# EAGLE schematic alte_schaltung_nicer2 (EAGLE 6.5.0)
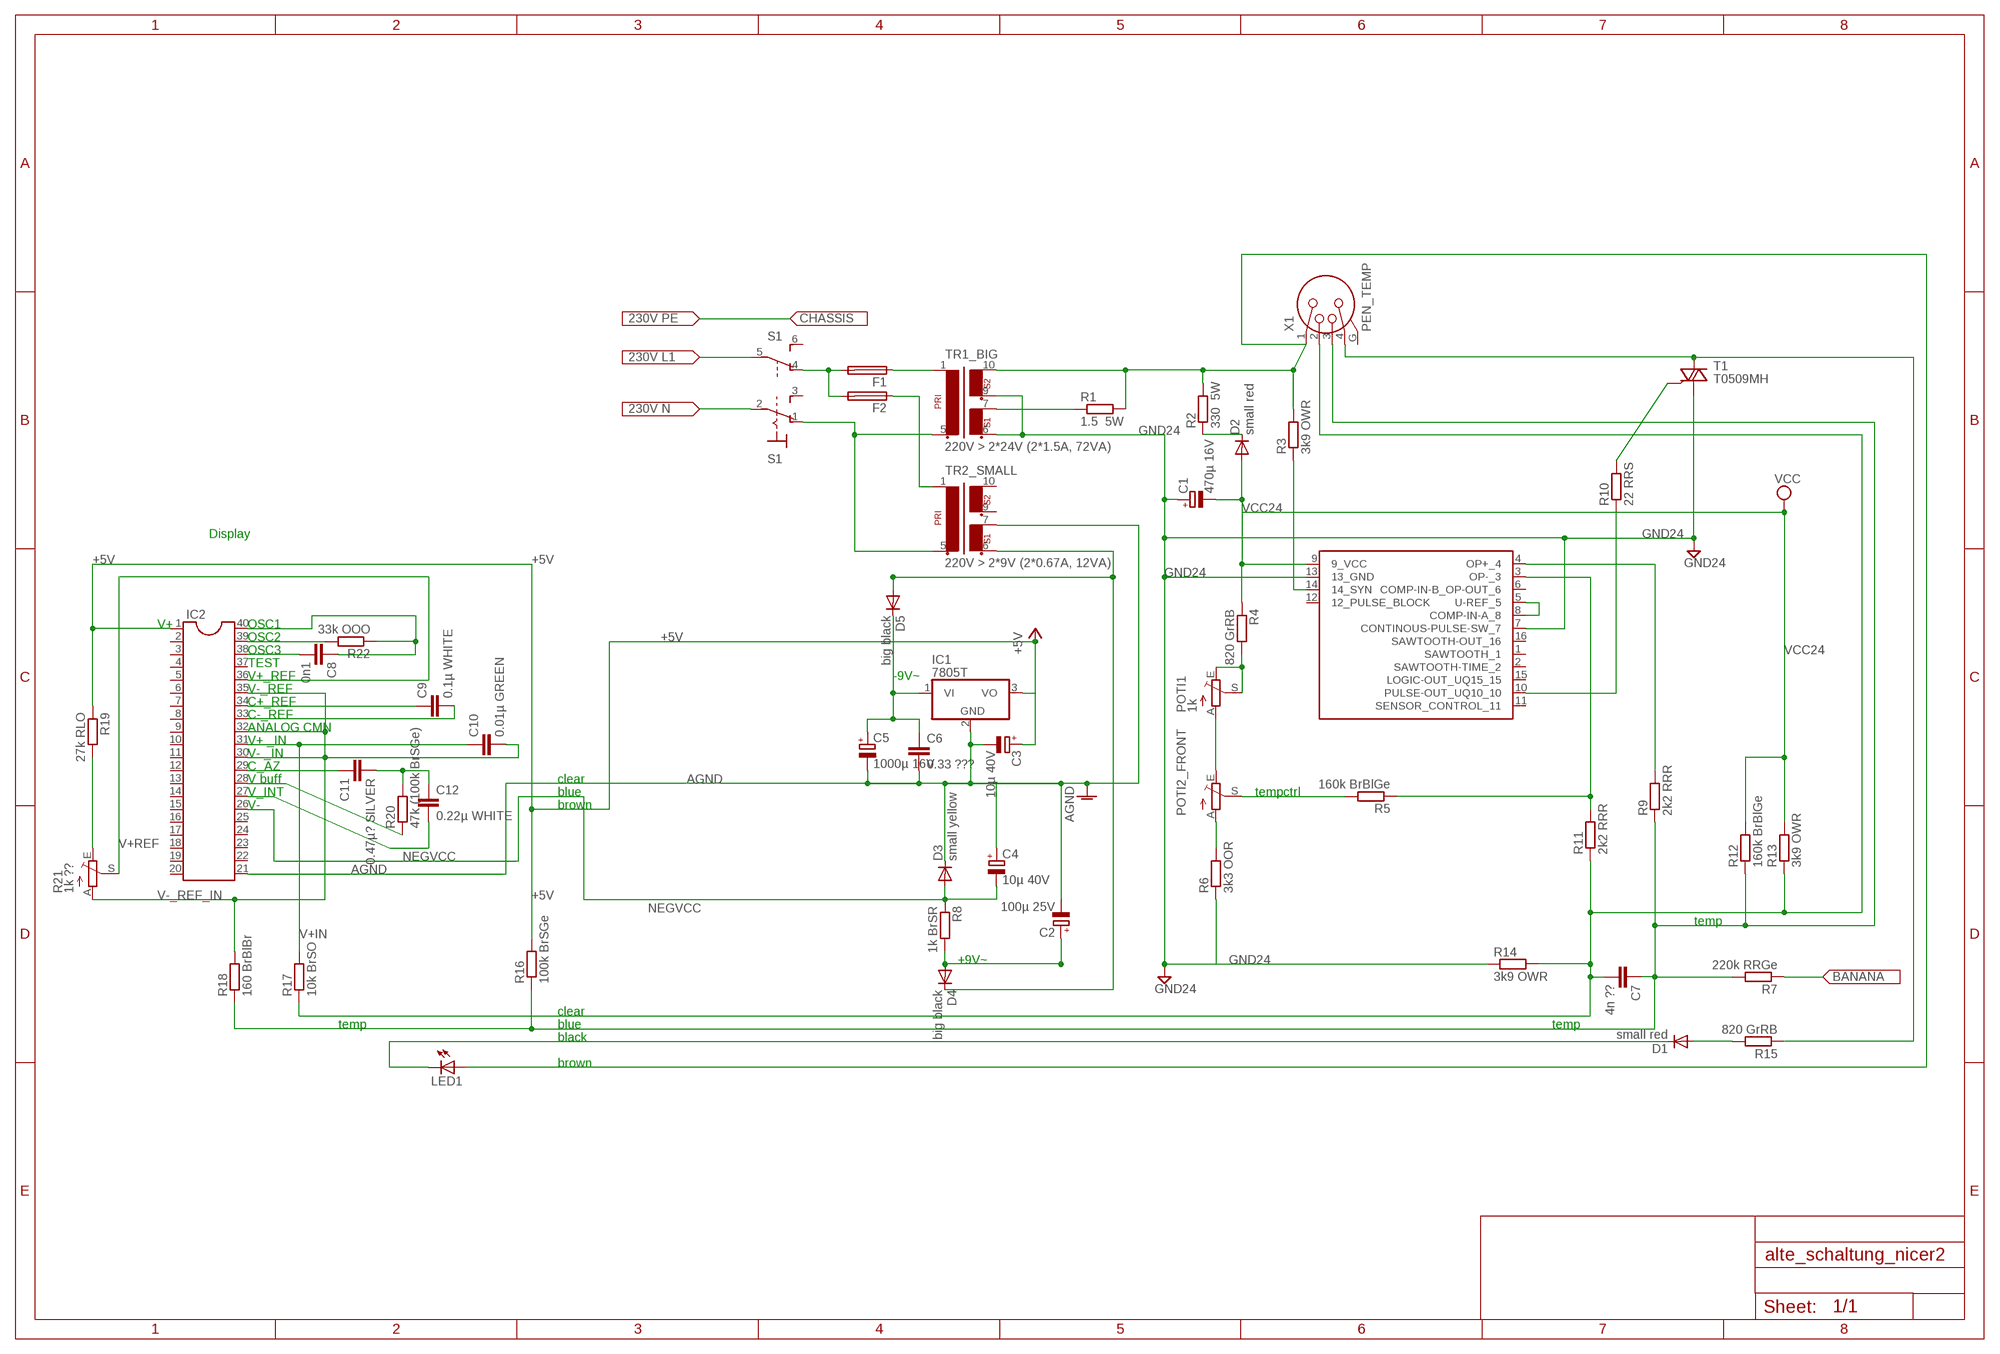
[diagram p0: schematic, sheet 1]

## Parts
C1  470µ 16V  CPOL-EUE5-10.5  [E5-10,5]
C2  100µ 25V  CPOL-EUE5-10.5  [E5-10,5]
C3  10µ 40V  CPOL-EUE5-10.5  [E5-10,5]
C4  10µ 40V  CPOL-EUE5-10.5  [E5-10,5]
C5  1000µ 16V  CPOL-EUE5-10.5  [E5-10,5]
C6  0.33 ???  C-EU075-042X103  [C075-042X103]
C7  4n ??  C-EU050-024X044  [C050-024X044]
C8  0n1  C-EU050-024X044  [C050-024X044]
C9  0.1µ WHITE  C-EU102-043X133  [C102-043X133]
C10  0.01µ GREEN  C-EU102-043X133  [C102-043X133]
C11  0.47µ? SILVER  C-EU102-043X133  [C102-043X133]
C12  0.22µ WHITE  C-EU102-043X133  [C102-043X133]
D1  small red  1N4004  [DO41-10]
D2  small red  1N4004  [DO41-10]
D3  small yellow  1N4446  [DO35-10]
D4  big black  1N4942  [DO41-10]
D5  big black  1N4942  [DO41-10]
F1  SH25  [SH25]
F2  SH25  [SH25]
IC1  7805T  [TO220H]
IC2  DIL40  [DIL40]
LED1  LED3MM  [LED3MM]
POTI1  1k  TRIM_EU-LI10  [LI10]
POTI2_FRONT  TRIM_EU-RJ9W  [RJ9W]
R1  1.5 5W  R-EU_0922/22  [0922/22]
R2  330 5W  R-EU_0922/22  [0922/22]
R3  3k9 OWR  R-EU_0207/12  [0207/12]
R4  820 GrRB  R-EU_0207/12  [0207/12]
R5  160k BrBlGe  R-EU_0207/12  [0207/12]
R6  3k3 OOR  R-EU_0207/12  [0207/12]
R7  220k RRGe  R-EU_0207/12  [0207/12]
R8  1k BrSR  R-EU_0207/12  [0207/12]
R9  2k2 RRR  R-EU_0207/12  [0207/12]
R10  22 RRS  R-EU_0207/12  [0207/12]
R11  2k2 RRR  R-EU_0207/12  [0207/12]
R12  160k BrBlGe  R-EU_0207/12  [0207/12]
R13  3k9 OWR  R-EU_0207/12  [0207/12]
R14  3k9 OWR  R-EU_0207/12  [0207/12]
R15  820 GrRB  R-EU_0207/12  [0207/12]
R16  100k BrSGe  R-EU_0207/12  [0207/12]
R17  10k BrSO  R-EU_0207/12  [0207/12]
R18  160 BrBlBr  R-EU_0207/12  [0207/12]
R19  27k RLO  R-EU_0207/12  [0207/12]
R20  47k (100k BrSGe)  R-EU_0207/12  [0207/12]
R21  1k ??  TRIM_EU-B90P  [SP19L]
R22  33k OOO  R-EU_0207/12  [0207/12]
S1  320-938  [320-938]
T1  T0509MH  BT136  [TO220AB]
TR1_BIG  220V > 2*24V (2*1.5A, 72VA)  EI42-2  [EI42-2]
TR2_SMALL  220V > 2*9V (2*0.67A, 12VA)  EI42-2  [EI42-2]
U$1  U106BS-DIL16  [DIL16]
X1  PEN_TEMP  NC4FBV  [NC4FBV]

## Nets
+5V: C3.+ IC1.3(VO) IC2.1 R16.2 R19.1
AGND: C2.- C3.- C4.+ C5.- C6.2 D3.C IC1.2(GND) IC2.21 TR2_SMALL.7
GND24: C1.+ R6.1 R14.1 T1.1(A1) TR1_BIG.6 TR1_BIG.9 U$1.7(CONTINOUS-PULSE-SW_7) U$1.13(13_GND)
N$2: S1.5(B:P)
N$3: S1.2(1:P)
N$4: F1.2 F2.2 S1.4(B:O)
N$5: F1.1 TR1_BIG.1
N$6: F2.1 TR2_SMALL.1
N$7: S1.1(1:O) TR1_BIG.5 TR2_SMALL.5
N$8: C12.2 IC2.27
N$9: LED1.A R1.2 R2.2 R3.2 TR1_BIG.10 X1.1
N$10: R1.1 TR1_BIG.7
N$11: D4.C D5.A TR2_SMALL.6
N$12: C2.+ D4.A R8.2
N$13: C5.+ C6.1 D5.C IC1.1(VI)
N$15: D1.A R15.2
N$16: R9.2 U$1.4(OP+_4)
N$17: C7.1 R7.2 R9.1 R12.1 R16.1 R18.1 X1.3
N$18: D1.C LED1.K(C)
N$19: POTI2_FRONT.S R5.2
N$20: C7.2 R11.1 R13.1 R14.2 R17.1 X1.2
N$21: POTI2_FRONT.A R6.2
N$22: R15.1 T1.2(A2) X1.4
N$23: R5.1 R11.2 U$1.3(OP-_3)
N$24: D2.C R2.1
N$25: R19.2 R21.E
N$26: POTI1.A POTI2_FRONT.E
N$27: POTI1.E POTI1.S R4.2
N$28: R10.2 T1.3(G)
N$29: R10.1 U$1.10(PULSE-OUT_UQ10_10)
N$30: R7.1
N$31: U$1.5(U-REF_5) U$1.8(COMP-IN-A_8)
N$32: R3.1 U$1.14(14_SYN)
N$36: C8.2 IC2.38
N$37: IC2.39 R22.2
N$38: C8.1 IC2.40 R22.1
N$39: IC2.28 R20.1
N$40: C9.1 IC2.34
N$41: C9.2 IC2.33
N$42: C11.1 IC2.29
N$43: C11.2 C12.1 R20.2
NEGVCC: C4.- D3.A IC2.26 R8.1
V+IN: C10.1 IC2.31 R17.2
V+REF: IC2.36 R21.S
V-_REF_IN: C10.2 IC2.30 IC2.32 IC2.35 R18.2 R21.A
VCC24: C1.- D2.A R4.1 R12.2 R13.2 U$1.9(9_VCC) ; supply symbol labelled VCC
Unconnected: IC2.2 IC2.3 IC2.4 IC2.5 IC2.6 IC2.7 IC2.8 IC2.9 IC2.10 IC2.11 IC2.12 IC2.13 IC2.14 IC2.15 IC2.16 IC2.17 IC2.18 IC2.19 IC2.20 IC2.22 IC2.23 IC2.24 IC2.25 IC2.37 S1.3(1:S) S1.6(B:S) TR2_SMALL.9 TR2_SMALL.10 U$1.1(SAWTOOTH_1) U$1.2(SAWTOOTH-TIME_2) U$1.6(COMP-IN-B_OP-OUT_6) U$1.11(SENSOR_CONTROL_11) U$1.12(12_PULSE_BLOCK) U$1.15(LOGIC-OUT_UQ15_15) U$1.16(SAWTOOTH-OUT_16) X1.G

## Notes on the sheet
- Display
- V+ | OSC1
- OSC2
- OSC3
- TEST
- V+_REF | -9V~
- V-_REF
- C+_REF
- C-_REF
- ANALOG CMN
- V+ _IN
- V- _IN
- C_AZ
- V buff | clear
- V_INT | blue | tempctrl
- V- | brown
- temp
- +9V~
- clear
- temp | blue | temp
- black
- brown

## Library data of the parts
C1-C5 = rcl:CPOL-EU: POLARIZED CAPACITOR, European symbol
C6-C12 = rcl:C-EU: CAPACITOR, European symbol
D1 D2 = diode:1N4004: DIODE general purpose rectifier, 1 A
D3 = diode:1N4446: DIODE high speed (Philips)
D4 D5 = diode:1N4942: DIODE 1.0 A, 200 V, 150 ns
F1 F2 = fuse:SH25: FUSE HOLDER grid 25 mm, OGN0031 8211, Schurter (Buerklin); MF: SCHURTER; MPN: 0031.8211; OC_FARNELL: 1162741; OC_NEWARK: 96B9380
IC1 = linear:78*: Positive VOLTAGE REGULATOR Source: http://cache.national.com/ds/LM/LM78L05.pdf http://www.fairchildsemi.com/ds/LM/LM7805.pdf
IC2 = ic-package:DIL40: Dual In Line
LED1 = led:LED: LED OSRAM: - CHIPLED LG R971, LG N971, LY N971, LG Q971, LY Q971, LO R971, LY R971 LH N974, LH R974 LS Q976, LO Q976, LY Q976 LO Q996 - Hyper CHIPLED LW Q18S LB Q993, LB Q99A, LB R99A - SideLED LS A670, LO A670, LY A670, LG A670, LP A670 LB A673, LV A673, LT A673, LW A673 LH A674 LY A675 LS A676, LA A676, LO A676, LY A676, LW A676 LS A679, LY A679, LG A679 - Hyper Micro SIDELED® LS Y876, LA Y876, LO Y876, LY Y876 LT Y87S - SmartLED LW L88C, LW L88S LB L89C, LB L89S, LG L890 LS L89K, LO L89K, LY L89K LS L896, LA L896, LO L896, LY L896 - TOPLED LS T670, LO T670, LY T670, LG T670, LP T670 LSG T670, LSP T670, LSY T670, LOP T670, LYG T670 LG T671, LOG T671, LSG T671 LB T673, LV T673, LT T673, LW T673 LH T674 LS T676, LA T676, LO T676, LY T676, LB T676, LH T676, LSB T676, LW T676 LB T67C, LV T67C, LT T67C, LS T67K, LO T67K, LY T67K, LW E67C LS E67B, LA E67B, LO E67B, LY E67B, LB E67C, LV E67C, LT E67C LW T67C LS T679, LY T679, LG T679 LS T770, LO T770, LY T770, LG T770, LP T770 LB T773, LV T773, LT T773, LW T773 LH T774 LS E675, LA E675, LY E675, LS T675 LS T776, LA T776, LO T776, LY T776, LB T776 LHGB T686 LT T68C, LB T68C - Hyper Mini TOPLED® LB M676 - Mini TOPLED Santana® LG M470 LS M47K, LO M47K, LY M47K Source: http://www.osram.convergy.de LUXEON: - LUMILED® LXK2-PW12-R00, LXK2-PW12-S00, LXK2-PW14-U00, LXK2-PW14-V00 LXK2-PM12-R00, LXK2-PM12-S00, LXK2-PM14-U00 LXK2-PE12-Q00, LXK2-PE12-R00, LXK2-PE12-S00, LXK2-PE14-T00, LXK2-PE14-U00 LXK2-PB12-K00, LXK2-PB12-L00, LXK2-PB12-M00, LXK2-PB14-N00, LXK2-PB14-P00, LXK2-PB14-Q00 LXK2-PR12-L00, LXK2-PR12-M00, LXK2-PR14-Q00, LXK2-PR14-R00 LXK2-PD12-Q00, LXK2-PD12-R00, LXK2-PD12-S00 LXK2-PH12-R00, LXK2-PH12-S00 LXK2-PL12-P00, LXK2-PL12-Q00, LXK2-PL12-R00 Source: www.luxeon.com KINGBRIGHT: KA-3528ASYC Source: www.kingbright.com
POTI1 POTI2_FRONT R21 = pot:TRIM_EU-: POTENTIOMETER
R1-R20 R22 = resistor:R-EU_: RESISTOR, European symbol
S1 = switch:320-938: TOGGLE SWITCH distributor RS Components
T1 = triac:BT136: Triac BT136 series E sensitive gate Source: http://www.nxp.com/acrobat_download/datasheets/BT136_SERIES_E_2.pdf
TR1_BIG TR2_SMALL = trafo:EI42-2: TRANSFORMER 1 primary winding, 2 secondary windings ERA
U$1 = U106BS:U106BS-DIL16
X1 = con-neutrik_ag:NC4: Neutrik Audio Connector XLR SERIES Stereo 1/4" jack Source: www.neutrik.com/; MPN: NC4FBV; OC_FARNELL: unknown; OC_NEWARK: 10J0667